# EAGLE design Arduino-Ethernet-v11 (EAGLE 5.06)

## Sheet 1 of 2
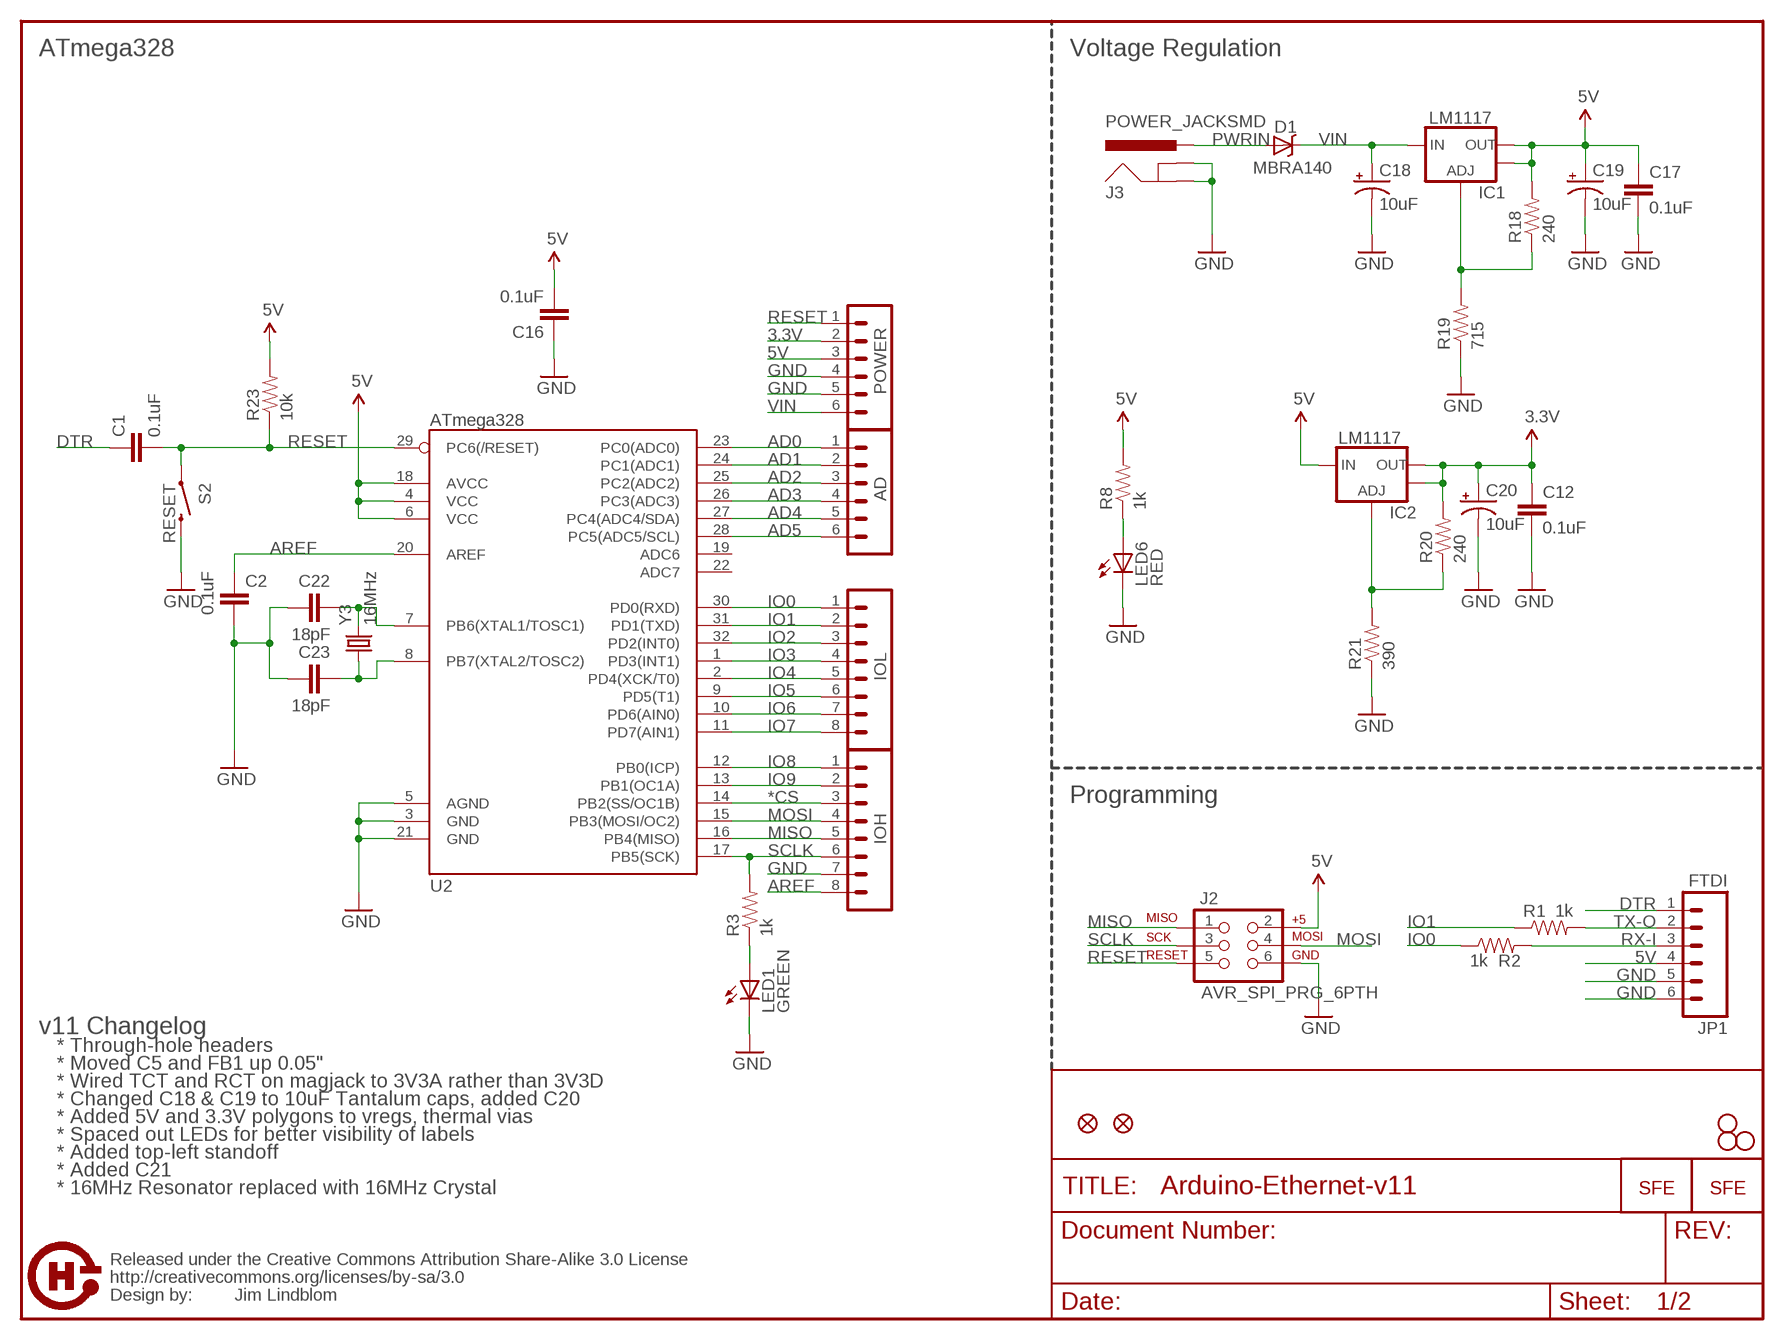
[diagram p0: schematic, sheet 1]

### Parts
$$U$1  CREATIVE_COMMONS  [CREATIVE_COMMONS]
AD  M06SIP  [1X06]
C1  0.1uF  CAP0402-CAP  [0402-CAP]
C2  0.1uF  CAP0402-CAP  [0402-CAP]
C12  0.1uF  CAP0402-CAP  [0402-CAP]
C16  0.1uF  CAP0402-CAP  [0402-CAP]
C17  0.1uF  CAP0402-CAP  [0402-CAP]
C18  10uF  CAP_POL1206  [EIA3216]
C19  10uF  CAP_POL1206  [EIA3216]
C20  10uF  CAP_POL1206  [EIA3216]
C22  18pF  CAP0402-CAP  [0402-CAP]
C23  18pF  CAP0402-CAP  [0402-CAP]
D1  MBRA140  DIODE-SCHOTTKY_  [SMA-DIODE]
IC1  LM1117  V_REG_LM1117SOT223  [SOT223]
IC2  LM1117  V_REG_LM1117SOT223  [SOT223]
IOH  M08  [1X08]
IOL  M08  [1X08]
J2  AVR_SPI_PRG_6PTH  [2X3]
J3  POWER_JACKSMD  [POWER_JACK_SMD]
JP1  FTDI  M06SMD  [1X06-SMD]
JP2  STAND-OFF  [STAND-OFF]
JP3  LOGO-SFENW2  [SFE-NEW-WEB]
JP4  STAND-OFF  [STAND-OFF]
JP7  LOGO-SFESK  [SFE-LOGO-FLAME]
JP8  STAND-OFF  [STAND-OFF]
JP9  FIDUCIAL1X2  [FIDUCIAL-1X2]
JP10  FIDUCIAL1X2  [FIDUCIAL-1X2]
LED1  GREEN  LED0603  [LED-0603]
LED6  RED  LED0603  [LED-0603]
POWER  M06SIP  [1X06]
R1  1k  RESISTOR0402-RES  [0402-RES]
R2  1k  RESISTOR0402-RES  [0402-RES]
R3  1k  RESISTOR0402-RES  [0402-RES]
R8  1k  RESISTOR0402-RES  [0402-RES]
R18  240  RESISTOR0402-RES  [0402-RES]
R19  715  RESISTOR0402-RES  [0402-RES]
R20  240  RESISTOR0402-RES  [0402-RES]
R21  390  RESISTOR0402-RES  [0402-RES]
R23  10k  RESISTOR0402-RES  [0402-RES]
S2  RESET  SWITCH-MOMENTARY-2SMD  [TACTILE_SWITCH_SMD]
U2  ATmega328  ATMEGA168  [TQFP32-08]
U$100  OSHW-LOGO  [OSHW-LOGO]
Y3  16MHz  CRYSTAL5X3  [CRYSTAL-SMD-5X3]

### Nets
3.3V: C12.1 C20.A(+) IC2.2(OUT) IC2.4(OUT) POWER.2 R20.2 ; also sheet 2
5V: C16.2 C17.1 C19.A(+) IC1.2(OUT) IC1.4(OUT) IC2.3(IN) J2.2 JP1.4 POWER.3 R8.2 R18.2 R23.2 U2.4(VCC) U2.6(VCC) U2.18(AVCC)
*CS: IOH.3 U2.14(PB2(SS/OC1B)) ; also sheet 2
AD0: AD.1 U2.23(PC0(ADC0))
AD1: AD.2 U2.24(PC1(ADC1))
AD2: AD.3 U2.25(PC2(ADC2))
AD3: AD.4 U2.26(PC3(ADC3))
AD4: AD.5 U2.27(PC4(ADC4/SDA))
AD5: AD.6 U2.28(PC5(ADC5/SCL))
AREF: C2.1 IOH.8 U2.20(AREF)
DTR: C1.1 JP1.1
GND: C2.2 C12.2 C16.1 C17.2 C18.C(-) C19.C(-) C20.C(-) C22.1 C23.1 IOH.7 J2.6 J3.GND(GNDBREAK) J3.P$4(GND) JP1.5 JP1.6 LED1.C LED6.C POWER.4 POWER.5 R19.1 R21.1 S2.3 U2.3(GND) U2.5(AGND) U2.21(GND) ; also sheet 2
IO0: IOL.1 R2.1 U2.30(PD0(RXD))
IO1: IOL.2 R1.1 U2.31(PD1(TXD))
IO2: IOL.3 U2.32(PD2(INT0)) ; also sheet 2
IO3: IOL.4 U2.1(PD3(INT1))
IO4: IOL.5 U2.2(PD4(XCK/T0))
IO5: IOL.6 U2.9(PD5(T1))
IO6: IOL.7 U2.10(PD6(AIN0))
IO7: IOL.8 U2.11(PD7(AIN1))
IO8: IOH.1 U2.12(PB0(ICP))
IO9: IOH.2 U2.13(PB1(OC1A))
MISO: IOH.5 J2.1 U2.16(PB4(MISO)) ; also sheet 2
MOSI: IOH.4 J2.4 U2.15(PB3(MOSI/OC2)) ; also sheet 2
N$1: LED1.A R3.1
N$6: C22.2 U2.7(PB6(XTAL1/TOSC1)) Y3.3
N$8: LED6.A R8.1
N$13: IC2.1(ADJ) R20.1 R21.2
N$16: C23.2 U2.8(PB7(XTAL2/TOSC2)) Y3.1
N$17: IC1.1(ADJ) R18.1 R19.2
PWRIN: D1.A J3.VIN0(PWR)
RESET: C1.2 J2.5 POWER.1 R23.1 S2.1 U2.29(PC6(/RESET)) ; also sheet 2
RX-I: JP1.3 R2.2
SCLK: IOH.6 J2.3 R3.2 U2.17(PB5(SCK)) ; also sheet 2
TX-O: JP1.2 R1.2
VIN: C18.A(+) D1.C IC1.3(IN) POWER.6
Unconnected: U2.19(ADC6) U2.22(ADC7)

### Notes on the sheet
- ATmega328 | Voltage Regulation
- Programming
- v11 Changelog
- * Through-hole headers
- * Moved C5 and FB1 up 0.05"
- * Wired TCT and RCT on magjack to 3V3A rather than 3V3D
- * Changed C18 & C19 to 10uF Tantalum caps, added C20
- * Added 5V and 3.3V polygons to vregs, thermal vias
- * Spaced out LEDs for better visibility of labels
- * Added top-left standoff
- * Added C21
- * 16MHz Resonator replaced with 16MHz Crystal
- Jim Lindblom

## Sheet 2 of 2
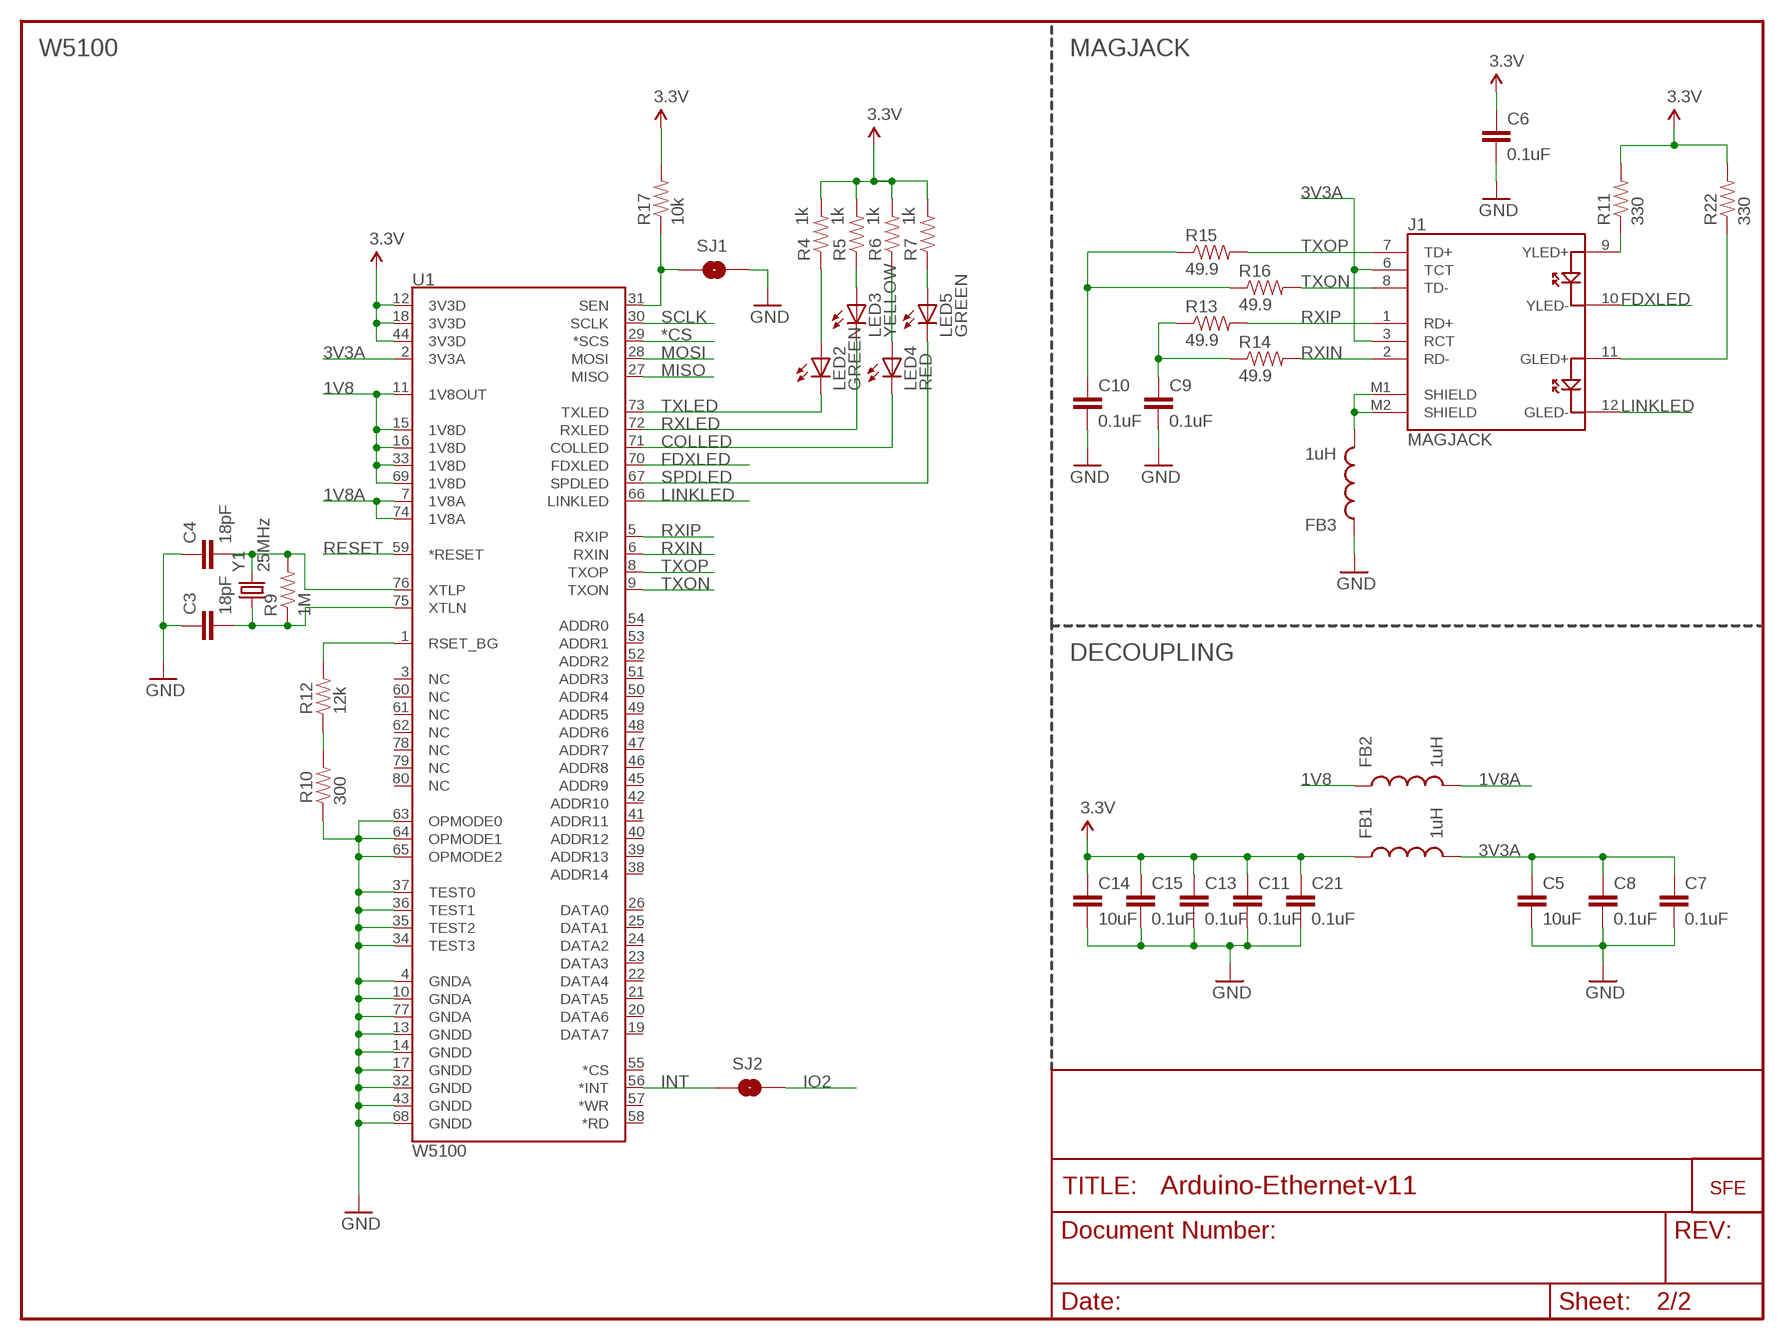
[diagram p1: schematic, sheet 2]

### Parts
C3  18pF  CAP0402-CAP  [0402-CAP]
C4  18pF  CAP0402-CAP  [0402-CAP]
C5  10uF  CAP1206  [1206]
C6  0.1uF  CAP0402-CAP  [0402-CAP]
C7  0.1uF  CAP0402-CAP  [0402-CAP]
C8  0.1uF  CAP0402-CAP  [0402-CAP]
C9  0.1uF  CAP0402-CAP  [0402-CAP]
C10  0.1uF  CAP0402-CAP  [0402-CAP]
C11  0.1uF  CAP0402-CAP  [0402-CAP]
C13  0.1uF  CAP0402-CAP  [0402-CAP]
C14  10uF  CAP1206  [1206]
C15  0.1uF  CAP0402-CAP  [0402-CAP]
C21  0.1uF  CAP0402-CAP  [0402-CAP]
FB1  1uH  INDUCTOR0805  [0805]
FB2  1uH  INDUCTOR0805  [0805]
FB3  1uH  INDUCTOR0805  [0805]
J1  MAGJACK  [MAGJACK]
JP6  LOGO-SFENEW  [SFE-NEW-WEBLOGO]
LED2  GREEN  LED0603  [LED-0603]
LED3  YELLOW  LED0603  [LED-0603]
LED4  RED  LED0603  [LED-0603]
LED5  GREEN  LED0603  [LED-0603]
R4  1k  RESISTOR0402-RES  [0402-RES]
R5  1k  RESISTOR0402-RES  [0402-RES]
R6  1k  RESISTOR0402-RES  [0402-RES]
R7  1k  RESISTOR0402-RES  [0402-RES]
R9  1M  RESISTOR0402-RES  [0402-RES]
R10  300  RESISTOR0402-RES  [0402-RES]
R11  330  RESISTOR0402-RES  [0402-RES]
R12  12k  RESISTOR0402-RES  [0402-RES]
R13  49.9  RESISTOR0402-RES  [0402-RES]
R14  49.9  RESISTOR0402-RES  [0402-RES]
R15  49.9  RESISTOR0402-RES  [0402-RES]
R16  49.9  RESISTOR0402-RES  [0402-RES]
R17  10k  RESISTOR0402-RES  [0402-RES]
R22  330  RESISTOR0402-RES  [0402-RES]
SJ1  SOLDERJUMPERNO  [SJ_2S-NO]
SJ2  SOLDERJUMPERNO  [SJ_2S-NO]
U1  W5100  [LQFP-80]
Y1  25MHz  CRYSTAL5X3  [CRYSTAL-SMD-5X3]

### Nets
1V8: FB2.1 U1.11(1V8OUT) U1.15(1V8D) U1.16(1V8D) U1.33(1V8D) U1.69(1V8D)
1V8A: FB2.2 U1.7(1V8A) U1.74(1V8A)
3.3V: C6.1 C11.1 C13.1 C14.1 C15.1 C21.1 FB1.1 R4.2 R5.2 R6.2 R7.2 R11.2 R17.2 R22.2 U1.12(3V3D) U1.18(3V3D) U1.44(3V3D) ; also sheet 1
3V3A: C5.1 C7.1 C8.1 FB1.2 J1.3(RCT) J1.6(TCT) U1.2(3V3A)
*CS: U1.29(*SCS) ; also sheet 1
CHGND: FB3.2 J1.M1(SHIELD) J1.M2(SHIELD)
COLLED: LED4.C U1.71(COLLED)
FDXLED: J1.10(YLED-) U1.70(FDXLED)
GND: C3.1 C4.1 C5.2 C6.2 C7.2 C8.2 C9.2 C10.2 C11.2 C13.2 C14.2 C15.2 C21.2 FB3.1 R10.1 SJ1.2 U1.4(GNDA) U1.10(GNDA) U1.13(GNDD) U1.14(GNDD) U1.17(GNDD) U1.32(GNDD) U1.34(TEST3) U1.35(TEST2) U1.36(TEST1) U1.37(TEST0) U1.43(GNDD) U1.63(OPMODE0) U1.64(OPMODE1) U1.65(OPMODE2) U1.68(GNDD) U1.77(GNDA) ; also sheet 1
INT: SJ2.1 U1.56(*INT)
IO2: SJ2.2 ; also sheet 1
LINKLED: J1.12(GLED-) U1.66(LINKLED)
MISO: U1.27(MISO) ; also sheet 1
MOSI: U1.28(MOSI) ; also sheet 1
N$2: C4.2 R9.2 U1.76(XTLP) Y1.3
N$3: C3.2 R9.1 U1.75(XTLN) Y1.1
N$4: J1.9(YLED+) R11.1
N$5: J1.11(GLED+) R22.1
N$7: C10.1 R15.1 R16.1
N$9: C9.1 R13.1 R14.1
N$10: LED2.A R4.1
N$11: LED3.A R5.1
N$12: LED4.A R6.1
N$14: LED5.A R7.1
N$15: R10.2 R12.1
RESET: U1.59(*RESET) ; also sheet 1
RSET_BG: R12.2 U1.1(RSET_BG)
RXIN: J1.2(RD-) R14.2 U1.6(RXIN)
RXIP: J1.1(RD+) R13.2 U1.5(RXIP)
RXLED: LED3.C U1.72(RXLED)
SCLK: U1.30(SCLK) ; also sheet 1
SEN: R17.1 SJ1.1 U1.31(SEN)
SPDLED: LED5.C U1.67(SPDLED)
TXLED: LED2.C U1.73(TXLED)
TXON: J1.8(TD-) R16.2 U1.9(TXON)
TXOP: J1.7(TD+) R15.2 U1.8(TXOP)
Unconnected: U1.3(NC) U1.19(DATA7) U1.20(DATA6) U1.21(DATA5) U1.22(DATA4) U1.23(DATA3) U1.24(DATA2) U1.25(DATA1) U1.26(DATA0) U1.38(ADDR14) U1.39(ADDR13) U1.40(ADDR12) U1.41(ADDR11) U1.42(ADDR10) U1.45(ADDR9) U1.46(ADDR8) U1.47(ADDR7) U1.48(ADDR6) U1.49(ADDR5) U1.50(ADDR4) U1.51(ADDR3) U1.52(ADDR2) U1.53(ADDR1) U1.54(ADDR0) U1.55(*CS) U1.57(*WR) U1.58(*RD) U1.60(NC) U1.61(NC) U1.62(NC) U1.78(NC) U1.79(NC) U1.80(NC)

### Notes on the sheet
- W5100 | MAGJACK
- DECOUPLING

## Library data of the parts
$$U$1 = SparkFun:CREATIVE_COMMONS
AD JP1 POWER = SparkFun:M06: Header 6 Standard 6-pin 0.1" header. Use with straight break away headers (SKU : PRT-00116), right angle break away headers (PRT-00553), swiss pins (PRT-00743), machine pins (PRT-00117), and female headers (PRT-00115). Molex polarized connector foot print use with SKU : PRT-08094 with associated crimp pins and housings. NOTES ON THE VARIANTS LOCK and LOCK_LONGPADS... This footprint was designed to help hold the alignment of a through-hole component (i.e. 6-pin header) while soldering it into place. You may notice that each hole has been shifted either up or down by 0.005 of an inch from it's more standard position (which is a perfectly straight line). This slight alteration caused the pins (the squares in the middle) to touch the edges of the holes. Because they are alternating, it causes a "brace" to hold the component in place. 0.005 has proven to be the perfect amount of "off-center" position when using our standard breakaway headers. Although looks a little odd when you look at the bare footprint, once you have a header in there, the alteration is very hard to notice. Also, if you push a header all the way into place, it is covered up entirely on the bottom side. This idea of altering the position of holes to aid alignment will be further integrated into the Sparkfun Library for other footprints. It can help hold any component with 3 or more connection pins.
C1-C17 C21-C23 = SparkFun:CAP: Capacitor Standard 0603 ceramic capacitor, and 0.1" leaded capacitor.
C18-C20 = SparkFun:CAP_POL: Capacitor Polarized These are standard SMD and PTH capacitors. Normally 10uF, 47uF, and 100uF in electrolytic and tantalum varieties. Always verify the external diameter of the through hole cap, it varies with capacity, voltage, and manufacturer. The EIA devices should be standard.
D1 = SparkFun:DIODE-SCHOTTKY
FB1-FB3 = SparkFun:INDUCTOR: Inductors Basic Inductor/Choke - 0603 and 1206. Footprints are not proven and vary greatly between part numbers.
IC1 IC2 = SparkFun:V_REG_LM1117: Voltage Regulator LM1117 Standard adjustable voltage regulator but in SMD form. Spark Fun Electronics SKU : COM-00595
IOH IOL = SparkFun:M08: Header 8 Standard 8-pin 0.1" header. Use with straight break away headers (SKU : PRT-00116), right angle break away headers (PRT-00553), swiss pins (PRT-00743), machine pins (PRT-00117), and female headers (PRT-00115).
J1 = SparkFun:MAGJACK
J2 = SparkFun:AVR_SPI_PRG_6: AVR ISP 6 Pin This is the reduced ISP connector for AVR programming. Common on Arduino. This footprint will take up less PCB space and can be used with a 10-pin to 6-pin adapter such as SKU: BOB-08508
J3 = SparkFun:POWER_JACK: Power Jack This is the standard 5.5mm barrel jack for power. The PTH is the most common, proven, reliable, footprint. All others are experimental. The Slot footprint only works if the mill layer is transmitted to the PCB fab house so be warned. Spark Fun Electronics SKU : PRT-00119. Mating wall wart : TOL-00298 (and others)
JP2 JP4 JP8 = SparkFun:STAND-OFF: Stand Off This is the mechanical footprint for a #4 phillips button head screw. Use the keepout ring to avoid running the screw head into surrounding components. SKU : PRT-00447
JP3 JP6 JP7 = SparkFun:LOGO-SFE: Spark Fun Electronics PCB Logo This is the standard Spark Fun Electronics PCB logo.
JP9 JP10 = SparkFun:FIDUCIAL: Fiducial Alignment Points Various fiducial points for machine vision alignment.
LED1-LED6 = SparkFun:LED: LEDs Standard schematic elements and footprints for 5mm, 3mm, 1206, and 0603 sized LEDs. 5mm - Spark Fun Electronics SKU : COM-00529 (and others)
R1-R23 = SparkFun:RESISTOR: Resistor Basic schematic elements and footprints for 0603, 1206, and PTH resistors.
S2 = SparkFun:SWITCH-MOMENTARY-2
SJ1 SJ2 = SparkFun:SOLDERJUMPER: Solder Jumper Standard SMD solder jumper. Used to automate production. Two varients : Normally Open and Normally Closed are the same, but have different paste layers. NC will have a large amount of paste and should jumper during reflow.
U1 = SparkFun:W5100: WIZnet W5100 TCP/IP PHY Embedded Chip See SparkFun catalog # COM-09471 Package: LQFP-80,10x10mm, 0.4mm pitch
U2 = SparkFun:ATMEGA168
U$100 = SparkFun:OSHW-LOGO
Y1 Y3 = SparkFun:CRYSTAL: Crystals Various standard crystals. Proven footprints. Spark Fun Electronics SKU : COM-00534

## Board
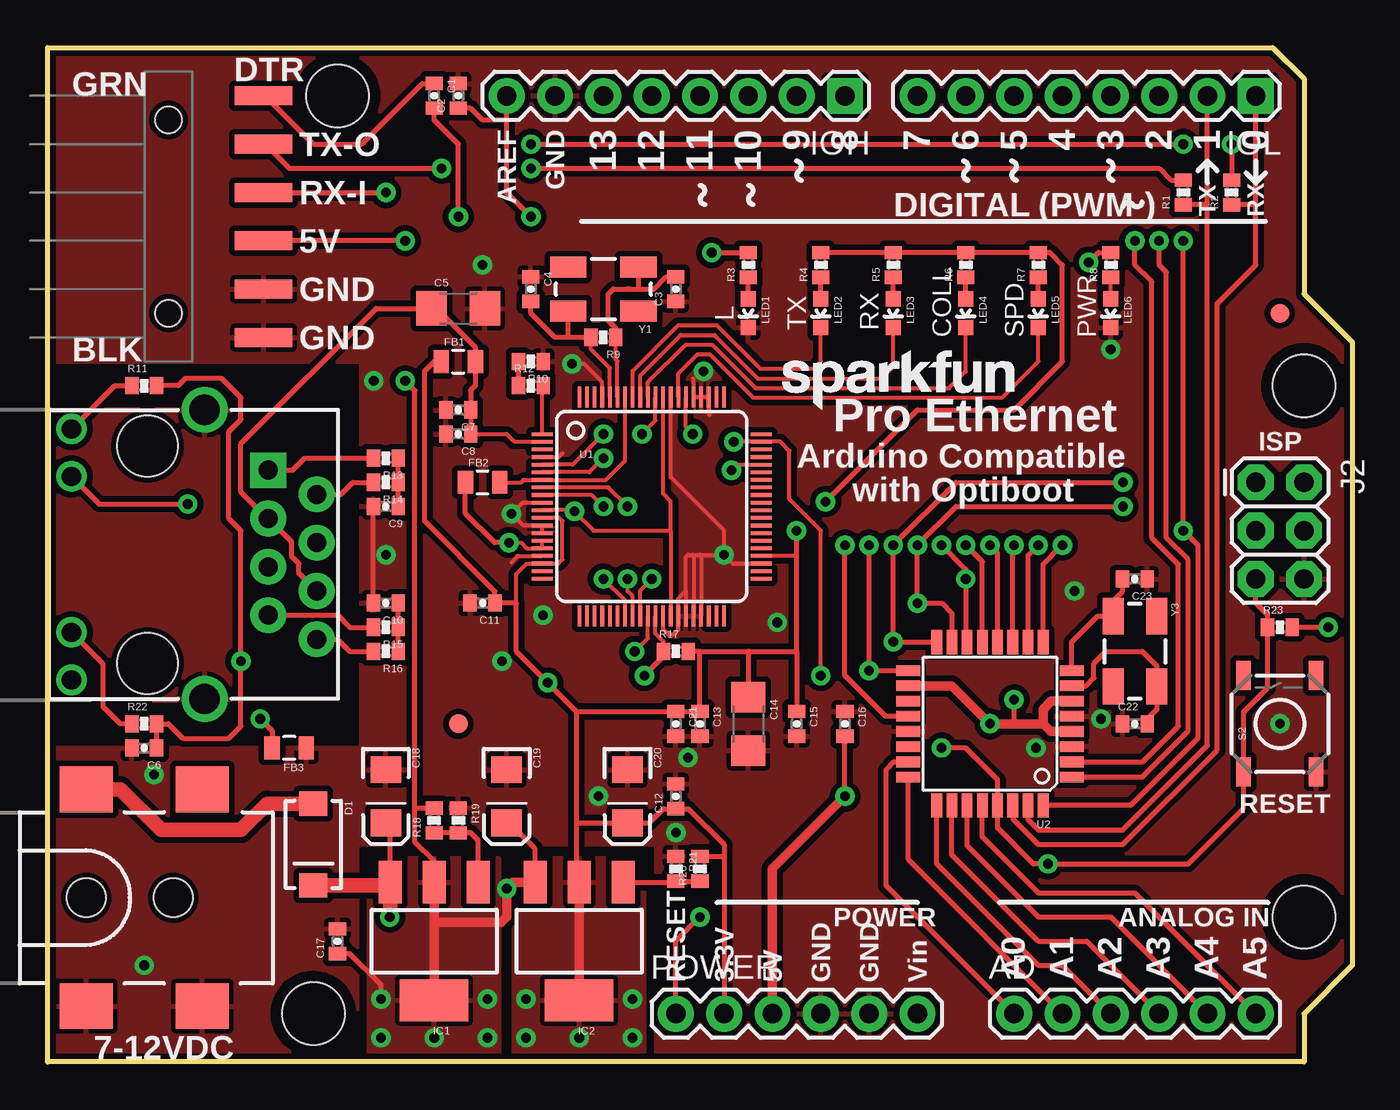
[diagram p2: board, top side]
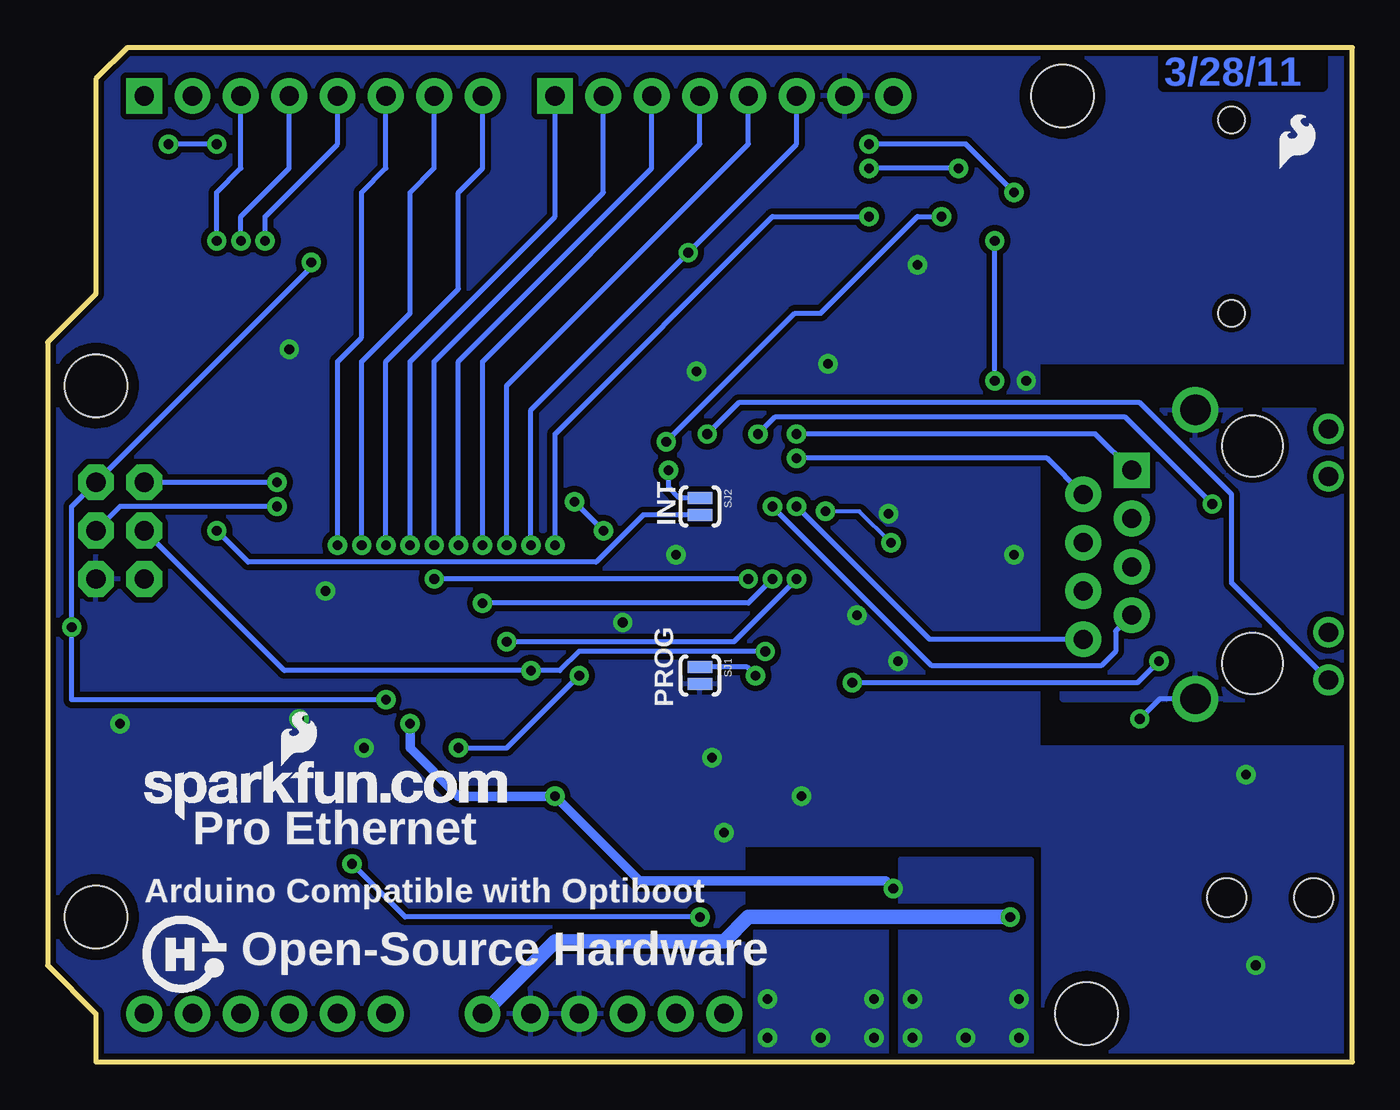
[diagram p3: board, bottom side, seen from below]

Size 68.58 x 53.34 mm. Coordinates in mm from the lower left corner, seen from the top.
Outline: 0,53.34 64.39,53.34 66.04,51.69 66.04,40.39 68.58,37.85 68.58,5.08 66.04,2.54 66.04,0 0,0 0,53.34
Copper layers (1*16): Top 0.035mm / dielectric 1.5mm / Bottom 0.035mm
Design rules "SparkFun *": minimum track width 8mil, minimum drill 20mil, track to track 8mil, track to pad 8mil, pad to pad 8mil, via to via 8mil, smd to smd 8mil, copper to edge 8mil, drill to drill 8mil, minimum pad ring 12mil, minimum via ring 10mil, stop-mask expansion 4mil, vias tented up to drill 20mil, thermal gap 10mil

### Footprints (pad centres in the part's own frame; a part is rotated, then mirrored left to right if it is on the bottom)
1X06 = drill 1.016 pad 1.88 round: 1 0,0; 2 2.54,0; 3 5.08,0; 4 7.62,0; 5 10.16,0; 6 12.7,0
0402-CAP = smd 0.7 x 0.9: 1 -0.65,0; 2 0.65,0
1206 = smd 1.6 x 1.8: 1 -1.4,0; 2 1.4,0
EIA3216 = smd 1.4 x 1.6: A 1.4,0; C -1.4,0
SMA-DIODE = smd 1.27 x 1.47: A -2.15,0; C 2.15,0
0805 = smd 0.8 x 1.2: 1 -0.9,0; 2 0.9,0
SOT223 = smd 1.219 x 2.235: 1 -2.311,-3.099; 2 0,-3.099; 3 2.311,-3.099 | smd 3.6 x 2.2: 4 0,3.099
1X08 = drill 1.016 pad 1.88 square: 1 0,0 | drill 1.016 pad 1.88 round: 2 2.54,0; 3 5.08,0; 4 7.62,0; 5 10.16,0; 6 12.7,0; 7 15.24,0; 8 17.78,0
MAGJACK = drill 1 pad 1.88 square: 1 3.175,17.445 | drill 1 pad 1.88 round: 2 4.445,19.985; 3 5.715,17.445; 4 6.985,19.985; 5 8.255,17.445; 6 9.525,19.985; 7 10.795,17.445; 8 12.065,19.985 | drill 1 pad 1.27 round: 9 1,7.1; 10 3.5,7.1; 11 11.7,7.1; 12 14.2,7.1 | drill 1.6 pad 2.184 round: M1 0,14.1; M2 15.2,14.1 | hole 3.2: 1.905,11.095; 13.335,11.095
2X3 = drill 1.016 pad 1.88 octagon: 1 0,0; 2 0,2.54; 3 2.54,0; 4 2.54,2.54; 5 5.08,0; 6 5.08,2.54
POWER_JACK_SMD = smd 2.8 x 2.4: GND 0,-5.7; P$4 6.1,-5.7; VIN0 0,5.7; VIN1 6.1,5.7 | hole 2.032: 0,0; 4.572,0
1X06-SMD = smd 1 x 3: 1 -6.35,5; 2 -3.81,5; 3 -1.27,5; 4 1.27,5; 5 3.81,5; 6 6.35,5 | hole 1.4: -5.08,0; 5.08,0
STAND-OFF = hole 3.302: 0,0
FIDUCIAL-1X2 = smd 1 x 1: 1 0,0
LED-0603 = smd 0.8 x 0.8: A 0,-0.75; C 0,0.75
0402-RES = smd 0.7 x 0.9: 1 -0.65,0; 2 0.65,0
TACTILE_SWITCH_SMD = smd 1.524 x 0.762: 1 -2.54,1.905; 2 2.54,1.905; 3 -2.54,-1.905; 4 2.54,-1.905
SJ_2S-NO = smd 0.635 x 1.27: 1 -0.45,0; 2 0.45,0
LQFP-80 = smd 0.19 x 1.1: 1 -3.8,-5.75; 2 -3.4,-5.75; 3 -3,-5.75; 4 -2.6,-5.75; 5 -2.2,-5.75; 6 -1.8,-5.75; 7 -1.4,-5.75; 8 -1,-5.75; 9 -0.6,-5.75; 10 -0.2,-5.75; 11 0.2,-5.75; 12 0.6,-5.75; 13 1,-5.75; 14 1.4,-5.75; 15 1.8,-5.75; 16 2.2,-5.75; 17 2.6,-5.75; 18 3,-5.75; 19 3.4,-5.75; 20 3.8,-5.75; 41 3.8,5.75; 42 3.4,5.75; 43 3,5.75; 44 2.6,5.75; 45 2.2,5.75; 46 1.8,5.75; 47 1.4,5.75; 48 1,5.75; 49 0.6,5.75; 50 0.2,5.75; 51 -0.2,5.75; 52 -0.6,5.75; 53 -1,5.75; 54 -1.4,5.75; 55 -1.8,5.75; 56 -2.2,5.75; 57 -2.6,5.75; 58 -3,5.75; 59 -3.4,5.75; 60 -3.8,5.75 | smd 1.1 x 0.19: 21 5.75,-3.8; 22 5.75,-3.4; 23 5.75,-3; 24 5.75,-2.6; 25 5.75,-2.2; 26 5.75,-1.8; 27 5.75,-1.4; 28 5.75,-1; 29 5.75,-0.6; 30 5.75,-0.2; 31 5.75,0.2; 32 5.75,0.6; 33 5.75,1; 34 5.75,1.4; 35 5.75,1.8; 36 5.75,2.2; 37 5.75,2.6; 38 5.75,3; 39 5.75,3.4; 40 5.75,3.8; 61 -5.75,3.8; 62 -5.75,3.4; 63 -5.75,3; 64 -5.75,2.6; 65 -5.75,2.2; 66 -5.75,1.8; 67 -5.75,1.4; 68 -5.75,1; 69 -5.75,0.6; 70 -5.75,0.2; 71 -5.75,-0.2; 72 -5.75,-0.6; 73 -5.75,-1; 74 -5.75,-1.4; 75 -5.75,-1.8; 76 -5.75,-2.2; 77 -5.75,-2.6; 78 -5.75,-3; 79 -5.75,-3.4; 80 -5.75,-3.8
TQFP32-08 = smd 1.27 x 0.559: 1 -4.293,2.8; 2 -4.293,2; 3 -4.293,1.2; 4 -4.293,0.4; 5 -4.293,-0.4; 6 -4.293,-1.2; 7 -4.293,-2; 8 -4.293,-2.8; 17 4.293,-2.8; 18 4.293,-2; 19 4.293,-1.2; 20 4.293,-0.4; 21 4.293,0.4; 22 4.293,1.2; 23 4.293,2; 24 4.293,2.8 | smd 0.559 x 1.27: 9 -2.8,-4.293; 10 -2,-4.293; 11 -1.2,-4.293; 12 -0.4,-4.293; 13 0.4,-4.293; 14 1.2,-4.293; 15 2,-4.293; 16 2.8,-4.293; 25 2.8,4.293; 26 2,4.293; 27 1.2,4.293; 28 0.4,4.293; 29 -0.4,4.293; 30 -1.2,4.293; 31 -2,4.293; 32 -2.8,4.293
CRYSTAL-SMD-5X3 = smd 1.9 x 1.1: 1 -1.85,-1.15; 2 1.85,-1.15; 3 1.85,1.15; 4 -1.85,1.15

### Placement (x,y rotation side)
$$U$1  0,-8.89 0 top  (outside the outline)
AD  50.8,2.54 0 top
C1  20.32,50.8 270 top
C2  21.59,50.8 90 top
C3  33.02,40.64 90 top
C4  25.4,40.64 270 top
C5  21.59,39.62 0 top
C6  5.08,16.51 180 top
C7  21.59,34.29 180 top
C8  21.59,33.02 180 top
C9  17.78,29.21 180 top
C10  17.78,24.13 180 top
C11  22.86,24.13 180 top
C12  33.02,13.97 90 top
C13  34.29,17.78 270 top
C14  36.83,17.78 270 top
C15  39.37,17.78 270 top
C16  41.91,17.78 270 top
C17  15.24,6.35 90 top
C18  17.78,13.97 270 top
C19  24.13,13.97 270 top
C20  30.48,13.97 270 top
C21  33.02,17.78 270 top
C22  57.15,17.78 0 top
C23  57.15,25.4 180 top
D1  13.97,11.43 270 top
FB1  21.59,36.83 0 top
FB2  22.86,30.48 0 top
FB3  12.7,16.51 180 top
IC1  20.32,6.35 180 top
IC2  27.94,6.35 180 top
IOH  41.91,50.8 180 top
IOL  63.5,50.8 180 top
J1  -5.84,34.29 270 top
J2  63.5,30.48 270 top
J3  2.03,8.64 0 top
JP1  6.35,44.45 270 top
JP2  66.04,35.56 0 top
JP3  38.61,34.29 0 top
JP4  66.04,7.62 0 top
JP5  STAND-OFF  [STAND-OFF]  13.97,2.54 0 top
JP6  63.5,12.7 0 bottom
JP7  3.81,46.99 0 bottom
JP8  15.24,50.8 0 top
JP9  64.77,39.37 0 top
JP10  21.59,17.78 0 top
LED1  36.83,39.37 180 top
LED2  40.64,39.37 180 top
LED3  44.45,39.37 180 top
LED4  48.26,39.37 180 top
LED5  52.07,39.37 180 top
LED6  55.88,39.37 180 top
POWER  33.02,2.54 0 top
R1  59.69,45.72 90 top
R2  62.23,45.72 90 top
R3  36.83,41.91 90 top
R4  40.64,41.91 90 top
R5  44.45,41.91 90 top
R6  48.26,41.91 90 top
R7  52.07,41.91 90 top
R8  55.88,41.91 90 top
R9  29.21,38.1 180 top
R10  25.4,36.83 180 top
R11  5.08,35.56 0 top
R12  25.4,35.56 0 top
R13  17.78,31.75 180 top
R14  17.78,30.48 180 top
R15  17.78,22.86 180 top
R16  17.78,21.59 180 top
R17  33.02,21.59 0 top
R18  20.32,12.7 90 top
R19  21.59,12.7 270 top
R20  34.29,10.16 90 top
R21  33.02,10.16 270 top
R22  5.08,17.78 0 top
R23  64.77,22.86 0 top
S2  64.77,17.78 90 top
SJ1  34.29,20.32 270 bottom
SJ2  34.29,29.21 270 bottom
U1  31.75,29.21 270 top
U2  49.53,17.78 180 top
U$100  61.59,5.71 0 bottom
Y1  29.21,40.64 180 top
Y3  57.15,21.59 270 top

### Tracks (layer width: path | path; a pad name or v marks a point on that pad's centre or on a via)
1V8  (via drill 0.51)
  Top 0.203: U1.15 U1.16 25.19,27.01 24.89,27.3 v24.26,27.3 | 32.75,27.94 U1.33 | 32.75,27.94 32.75,29.48 32.35,29.88 U1.69 | U1.11 27.63,29.01 v27.69,28.96 28.7,27.94 32.75,27.94
  Top 0.254: v24.26,27.3 23.5,27.3 21.96,28.84 FB2.1
  Bottom 0.203: v27.69,28.96 25.91,28.96 v24.26,27.3
1V8A
  Top 0.203: U1.74 30.35,31.62 29.34,30.61 U1.7 25.02,30.61 24.89,30.48 FB2.2
3.3V  (via drill 0.51)
  Top 0.203: U1.12 26.89,28.61 27.05,28.45 27.05,26.42 26.84,26.21 U1.18 25.19,26.21 24.64,25.65 24.64,24.13 | U1.44 39.31,26.61 39.37,26.67
  Top 0.254: 39.37,21.59 C15.1 | 39.37,21.59 39.37,26.67 v39.37,27.94 | 34.29,21.59 R17.2 | 34.29,21.59 36.83,21.59 | 36.83,21.59 39.37,21.59 | 34.29,21.59 C13.1 C21.1 27.8,18.43 | 36.83,21.59 C14.1 | R4.2 R5.2 R6.2 R7.2 52.69,42.56 53.34,41.91 53.34,36.83 50.8,34.29 45.72,34.29 v40.89,29.46 | C6.1 R22.2 6.35,17.78 7.11,17.02 9.53,17.02 10.16,17.65 v10.16,21.08 10.16,27.94 9.53,28.57 9.53,33.15 10.16,33.78 10.16,34.92 9.14,35.94 7.24,35.94 6.86,35.56 R11.2 | FB1.1 20.32,36.83 19.81,36.32 19.81,28.45 23.51,24.75 C11.1 24.64,24.13 24.64,21.59 v26.29,19.94 27.8,18.43 | R20.2 34.3,10.79 35.56,10.79 | C20.A 30.35,12.7 | C20.A 31.62,12.57 32.37,13.32 C12.1 33.67,13.32 35.56,11.43 35.56,10.79 | 35.56,10.79 POWER.2 | IC2.2 | 27.8,18.43 27.8,12.57 | 27.8,12.57 27.8,9.03 27.94,8.89 | C20.A 27.8,12.57
  Top 0.508: IC2.4 27.94,8.89 IC2.2
  Bottom 0.254: v39.37,27.94 v40.89,29.46 | v26.29,19.94 11.3,19.94 v10.16,21.08
  other vias: 25.15,1.27 25.15,3.3 27.94,1.27 30.73,1.27 30.73,3.3
  pour Bottom (isolate 0.305): 24.51,10.67 24.51,0 31.37,0 31.37,10.67
  pour Top (isolate 0.305): 24.51,10.67 24.51,0 31.37,0 31.37,10.67
3V3A
  Top 0.203: U1.2 24.54,32.61 24.13,33.02 C8.1
  Top 0.254: C8.1 C7.1 22.24,35.32 22.49,35.57 FB1.2 22.49,37.58 20.45,39.62 C5.1 17.27,39.62 10.16,32.51 10.16,29.97 11.56,28.57 J1.3 12.83,27.35 12.83,26.59 13.21,26.21 13.21,25.7 J1.6
5V  (via drill 0.51)
  Top 0.254: v67.31,22.86 R23.2 | v18.8,35.81 19.3,35.31 19.3,13.34 | v41.91,13.97 C16.2 | v18.8,43.18 JP1.4 | v54.72,42.05 55.23,42.56 R8.2 | C17.1 15.89,5.7 17.53,4.06 v17.53,3.3 | 19.3,13.34 19.3,11.56 20.32,10.54 IC1.2 | R18.2 19.32,13.35 19.3,13.34 | IC2.3 25.63,11.2 24.26,12.57 C19.A | 50.8,17.78 v50.8,19.05
  Top 0.508: U2.6 52.76,18.98 52.32,18.54 52.32,17.78 | U2.4 52.72,17.38 52.32,17.78 | 52.32,17.78 50.8,17.78 v49.53,17.78 47.53,19.78 U2.18 | IC1.4 20.32,7.24 | 20.32,7.24 IC1.2 | 20.32,7.24 20.42,7.34 23.85,7.34 24.13,7.62 24.13,8.89 | POWER.3 38.1,10.16 v41.91,13.97 | IC2.3 24.46,9.45 v24.13,9.12
  Bottom 0.254: 67.31,19.05 v67.31,22.86 | 67.31,19.05 67.31,29.21 J2.2 54.72,41.8 v54.72,42.05 | v50.8,19.05 67.31,19.05 | v18.8,35.81 v18.8,43.18
  Bottom 0.508: v49.53,17.78 49.53,16.51 46.99,13.97 v41.91,13.97 37.47,9.53 24.54,9.53 v24.13,9.12
  other vias: 17.53,1.27 23.11,3.3 23.11,1.27 20.32,1.27
  pour Bottom (isolate 0.305): 16.89,10.67 16.89,0 23.75,0 23.75,10.67
  pour Top (isolate 0.305): 16.89,10.67 16.89,0 23.75,0 23.75,10.67
*CS  (via drill 0.51)
  Top 0.203: U1.29 31.15,24.8 v31.75,25.4
  Top 0.254: U2.14 48.26,22.14 v48.26,25.4 48.26,25.91 v46.99,27.18
  Bottom 0.254: v31.75,25.4 v48.26,25.4 | IOH.3 36.83,46.99 46.99,36.83 v46.99,27.18
AD0
  Top 0.254: U2.23 44.48,15.78 44.07,15.37 44.07,9.27 AD.1
AD1
  Top 0.254: U2.24 45.24,10.64 AD.2
AD2
  Top 0.254: U2.25 46.73,10.42 52.07,5.08 53.34,5.08 AD.3
AD3
  Top 0.254: U2.26 47.53,10.89 52.07,6.35 54.61,6.35 AD.4
AD4
  Top 0.254: U2.27 48.33,11.36 52.07,7.62 55.88,7.62 AD.5
AD5
  Top 0.254: AD.6 57.15,8.89 52.07,8.89 49.13,11.83 U2.28
AREF  (via drill 0.51)
  Top 0.254: C2.1 22.24,50.15 22.86,49.53 24.13,49.53 | U2.20 44.05,18.18 41.91,20.32 v41.91,27.18 | 24.13,49.53 24.13,45.72 v25.4,44.45 | 24.13,49.53 IOH.8
  Bottom 0.254: v25.4,44.45 30.48,44.45 41.91,33.02 v41.91,27.18
CHGND  (via drill 0.51)
  Top 0.254: FB3.2 11.8,17.41 v11.18,18.03
  Bottom 0.254: J1.M2 10.12,19.09 v11.18,18.03
  pour Top (isolate 0.305): 0,19.05 15.24,19.05 15.24,34.29 0,34.29
  pour Bottom (isolate 0.305): 0,19.05 15.24,19.05 15.24,34.29 0,34.29
COLLED
  Top 0.203: LED4.C 48.26,36.32 47.37,35.43 37.21,35.43 34.92,37.72 33.53,37.72 31.55,35.74 U1.71
DTR
  Top 0.254: JP1.1 11.81,50.8 11.81,50.42 13.97,48.26 16.51,48.26 19.7,51.45 C1.1
FDXLED  (via drill 0.51)
  Top 0.203: U1.70 31.95,33.73 v31.24,33.02
  Top 0.254: J1.10 2.71,29.34 v7.37,29.34
  Bottom 0.254: v31.24,33.02 30.35,33.91 11.94,33.91 v7.37,29.34
GND  (via drill 0.51)
  Top 0.203: U1.32 32.35,22.77 32.64,22.48 32.89,22.48 33.15,22.74 U1.34 33.15,24.36 33.55,24.77 | U1.14 U1.13 25,28.21 v24.38,28.83 24.96,29.41 U1.10 | U1.17 24.7,26.61 24.38,26.29 | U1.77 29.15,35.75 28.19,36.7 v27.56,36.7 | 33.91,35.94 33.95,35.9 U1.65 U1.64 U1.63 34.75,34.08 34.8,34.04 | U1.4 26.86,31.81 27.05,32 | v35.56,26.67 35.56,27.94 32.75,30.75 U1.68 | v35.56,26.67 35.56,26.61 | U1.43 36.02,26.21 v35.56,26.67 | 33.91,26.67 33.66,26.67 33.55,26.57 33.55,24.77 | 33.91,26.67 34.29,26.67 | 34.29,26.67 v35.56,26.67 | 33.55,24.77 U1.35 | U1.36 33.95,26.63 33.91,26.67 | U1.37 34.35,26.61 34.29,26.67
  Top 0.254: C10.2 C9.2
  other vias: 26.04,23.5 55.37,18.03 38.35,23.11 23.88,21.08 22.86,41.91 51.94,16.51 53.98,24.77 5.08,5.08 55.88,37.47 34.48,36.32 17.14,35.81 64.77,17.78 17.78,26.67 5.59,15.11 33.66,16 28.96,13.97 33.02,12.06
  pour Top (isolate 0.305): 0,0 0,16.51 16.51,16.51 16.51,36.83 0,36.83 0,53.34 68.73,53.34 68.73,0 32,0 32,11.43 16.26,11.43 16.26,0
  pour Bottom (isolate 0.305): 0,0 0,16.51 16.51,16.51 16.51,36.83 0,36.83 -0.1,53.34 68.53,53.34 68.63,0 32,0 32,11.43 16.26,11.43 16.26,0
INT  (via drill 0.51)
  Top 0.203: U1.56 36.24,31.41 v35.94,31.11
  Bottom 0.254: v35.94,31.11 35.94,30.23 35.38,29.66 SJ2.1
IO0
  Top 0.254: 63.5,49.53 IOL.1 63.5,45.09 | U2.30 50.73,12.77 52.07,11.43 56.52,11.43 61.47,16.38 61.47,39.88 63.5,41.91 63.5,45.09 | R2.1 63.48,45.07 63.5,45.09
IO1
  Top 0.254: U2.31 51.53,12.73 52.07,12.19 56.52,12.19 60.96,16.64 60.96,45.09 | 60.96,45.09 IOL.2 | R1.1 60.95,45.07 60.96,45.09
IO2  (via drill 0.51)
  Top 0.254: v59.69,43.18 v59.69,27.94 60.45,27.18 60.45,17.02 56.92,13.49 U2.32
  Bottom 0.254: SJ2.2 37.28,28.76 39.75,26.29 58.04,26.29 v59.69,27.94 | IOL.3 58.42,46.99 59.69,45.72 v59.69,43.18
IO3  (via drill 0.51)
  Top 0.254: v58.42,43.18 58.42,41.91 58.8,41.53 58.8,27.56 59.94,26.42 59.94,17.4 57.52,14.98 U2.1
  Bottom 0.254: IOL.4 55.88,46.99 58.42,44.45 v58.42,43.18
IO4  (via drill 0.51)
  Top 0.254: v57.15,43.18 57.15,41.91 58.04,41.02 58.04,27.56 59.44,26.16 59.44,17.65 57.56,15.78 U2.2
  Bottom 0.254: IOL.5 53.34,48.26 57.15,44.45 v57.15,43.18
IO5  (via drill 0.51)
  Top 0.254: U2.9 52.33,26.17 v53.34,27.18
  Bottom 0.254: IOL.6 50.8,46.99 52.07,45.72 52.07,38.1 53.34,36.83 v53.34,27.18
IO6  (via drill 0.51)
  Top 0.254: U2.10 51.53,26.64 v52.07,27.18
  Bottom 0.254: IOL.7 48.26,46.99 49.53,45.72 49.53,39.37 52.07,36.83 v52.07,27.18
IO7  (via drill 0.51)
  Top 0.254: U2.11 50.73,27.11 v50.8,27.18
  Bottom 0.254: IOL.8 45.72,46.99 46.99,45.72 46.99,40.64 50.8,36.83 v50.8,27.18
IO8  (via drill 0.51)
  Top 0.254: U2.12 49.93,26.78 v49.53,27.18
  Bottom 0.254: IOH.1 41.91,44.45 49.53,36.83 v49.53,27.18
IO9  (via drill 0.51)
  Top 0.254: U2.13 49.13,26.31 v48.26,27.18
  Bottom 0.254: IOH.2 39.37,45.72 48.26,36.83 v48.26,27.18
LINKLED  (via drill 0.51)
  Top 0.203: U1.66 33.55,33.38 v33.91,33.02
  Bottom 0.254: J1.12 6.35,25.18 6.35,29.84 11.18,34.67 32.26,34.67 v33.91,33.02
MISO  (via drill 0.51)
  Top 0.203: U1.27 30.35,24.26 v29.21,25.4
  Top 0.254: U2.16 46.7,22.1 v44.45,22.1 v44.45,27.18 47.75,30.48 v56.52,30.48
  Bottom 0.254: v44.45,22.1 32.51,22.1 v29.21,25.4 | v56.52,30.48 J2.1 | IOH.5 31.75,48.26 44.45,35.56 v44.45,27.18
MOSI  (via drill 0.51)
  Top 0.203: U1.28 30.75,24.5 30.48,24.77 v30.48,25.4
  Top 0.254: U2.15 47.53,23.59 46.99,24.13 v45.72,24.13 v45.72,27.18 47.75,29.21 v56.52,29.21
  Bottom 0.254: J2.4 64.77,29.21 v56.52,29.21 | v30.48,25.4 31.75,24.13 v45.72,24.13 | IOH.4 34.29,48.26 45.72,36.83 v45.72,27.18
N$1
  Top 0.254: LED1.A R3.1
N$2
  Top 0.203: U1.76 29.55,36.49 28.56,37.48 R9.2
  Top 0.254: C4.2 25.4,39.37 26.67,38.1 27.3,38.1 | R9.2 27.3,38.1 | Y1.3 27.36,38.16 27.3,38.1
N$3
  Top 0.203: U1.75 29.95,36.85 29.86,36.94 R9.1
  Top 0.254: R9.1 29.86,38.59 29.46,38.99 29.46,40.39 29.72,40.64 30.48,40.64 | 30.48,40.64 30.61,40.64 | C3.2 32.53,41.29 31.88,40.64 31.11,40.64 | 30.48,40.64 31.11,40.64 | Y1.1 31.06,40.7 31.11,40.64
N$4
  Top 0.254: R11.1 3.53,35.56 J1.9
N$5
  Top 0.254: R22.1 3.81,17.78 2.92,18.67 2.92,20.93 J1.11
N$6
  Top 0.254: C22.2 57.8,18.03 58.3,18.53 Y3.3 58.3,20.82 57.53,21.59 55.63,21.59 54.99,20.95 54.99,20.19 54.58,19.78 U2.7
N$7
  Top 0.254: R16.1 R15.1 C10.1
N$8
  Top 0.203: LED6.A R8.1
N$9
  Top 0.254: R13.1 R14.1 C9.1
N$10
  Top 0.254: LED2.A R4.1
N$11
  Top 0.254: LED3.A R5.1
N$12
  Top 0.254: LED4.A R6.1
N$13
  Top 0.254: R20.1 R21.2 32.96,9.45 IC2.1
N$14
  Top 0.254: LED5.A R7.1
N$15
  Top 0.254: R10.2 R12.1
N$16
  Top 0.254: U2.8 53.82,22.07 55.19,23.44 Y3.1 56,24.25 56.5,24.75 C23.2
N$17
  Top 0.254: 22.86,9.65 22.63,9.42 IC1.1 22.63,11.66 22.24,12.05 R19.2 R18.1
PWRIN
  Top 0.762: J3.VIN0 3.83,14.34 5.97,12.19 10.16,12.19 11.55,13.58 D1.A
RESET  (via drill 0.51)
  Top 0.203: v36.07,32.61 U1.59 38.51,32.61 38.99,32.13 38.99,29.59 40.64,27.94 v40.64,20.32
  Top 0.254: v46.99,16.51 48.26,16.51 49.93,14.84 U2.29 49.93,12.3 51.82,10.41 v52.58,10.41 59.94,10.41 62.87,13.34 S2.1 62.87,18.41 64.12,19.67 R23.1 64.12,23.51 63.5,24.13 J2.5 | v21.59,44.45 21.59,48.26 20.32,49.53 C1.2 | v34.29,7.62 33.02,6.35 POWER.1
  Bottom 0.254: v40.64,20.32 44.45,16.51 v46.99,16.51 | v21.59,44.45 22.86,44.45 27.94,39.37 29.31,39.37 v36.07,32.61 | v34.29,7.62 49.78,7.62 v52.58,10.41
RSET_BG
  Top 0.203: U1.1 26,35.51 R12.2
RX-I  (via drill 0.51)
  Top 0.254: JP1.3 v17.78,45.72 | v25.4,48.26 v59.69,48.26 | v62.23,48.26 R2.2
  Bottom 0.254: v25.4,48.26 20.32,48.26 v17.78,45.72 | v59.69,48.26 v62.23,48.26
RXIN  (via drill 0.51)
  Top 0.203: U1.6 28.47,31.01 v29.21,31.75
  Top 0.254: R14.2 16.05,30.48 15.41,29.84 J1.2
  Bottom 0.254: v29.21,31.75 16.05,31.75 J1.2
RXIP  (via drill 0.51)
  Top 0.203: U1.5 27.6,31.41 v29.21,33.02
  Top 0.254: R13.2 13.51,31.75 12.87,31.11 J1.1
  Bottom 0.254: v29.21,33.02 13.51,33.02 J1.1
RXLED
  Top 0.203: LED3.C 44.45,36.58 43.81,35.94 37.34,35.94 35.05,38.23 33.27,38.23 31.15,36.1 U1.72
SCLK  (via drill 0.51)
  Top 0.203: U1.30 31.55,22.28 v30.86,21.59
  Top 0.254: U2.17 v43.18,20.58 v43.18,27.18 | v34.91,42.56 R3.2
  Bottom 0.254: v30.86,21.59 40.64,21.59 41.65,20.58 v43.18,20.58 56.14,20.58 J2.3 | IOH.6 29.21,48.26 v34.91,42.56 43.18,34.29 v43.18,27.18
SEN  (via drill 0.51)
  Top 0.203: U1.31 31.95,22.53 32.37,22.11 R17.1
  Top 0.254: R17.1 32.37,21.32 v31.37,20.32
  Bottom 0.254: SJ1.1 31.82,20.77 v31.37,20.32
SPDLED
  Top 0.203: LED5.C 52.07,36.83 50.16,34.92 37.08,34.92 34.8,37.21 34.16,37.21 33.15,36.2 U1.67
TX-O  (via drill 0.51)
  Top 0.254: v25.4,46.99 58.42,46.99 59.04,46.37 R1.2 | JP1.2 11.43,48.26 12.7,46.99 v20.7,46.99
  Bottom 0.254: v20.7,46.99 v25.4,46.99
TXLED
  Top 0.203: LED2.C 40.64,36.83 40.26,36.45 37.47,36.45 35.18,38.73 33.15,38.73 30.75,36.34 U1.73
TXON  (via drill 0.51)
  Top 0.203: U1.9 28.61,29.81 v29.21,29.21
  Top 0.254: J1.8 15.24,22.23 15.88,21.59 R16.2
  Bottom 0.254: J1.8 22.23,22.23 v29.21,29.21
TXOP  (via drill 0.51)
  Top 0.203: U1.8 29.48,30.21 v30.48,29.21
  Top 0.254: J1.7 15.24,23.5 15.88,22.86 R15.2
  Bottom 0.254: v30.48,29.21 22.1,20.83 13.21,20.83 12.45,21.59 12.45,22.65 J1.7
VIN  (via drill 0.51)
  Top 0.254: IC1.3 18.01,12.34 C18.A
  Top 0.762: IC1.3 17.98,9.42 17.98,8.89 17.59,9.28 D1.C | IC1.3 17.92,9.53 | v17.98,7.62 18.01,7.64 IC1.3
  Bottom 0.762: POWER.6 41.91,6.35 33.02,6.35 31.75,7.62 v17.98,7.62

### Text on the board
Bottom: 3/28/11
tPlace: DTR | GRN | AREF | GND | 13 | 12 | 11 | 10 | 9 | 8 | 7 | 6 | 5 | 4 | 3 | 2 | 1 | 0 | TX-O | RX-I | DIGITAL | (PWM | ) | TX | RX | 5V | GND | L | TX | RX | COLL | SPD | PWR | BLK | GND | Pro Ethernet | ISP | Arduino Compatible | with Optiboot | RESET | POWER | ANALOG IN | RESET | 3.3V | 5V | GND | GND | Vin | A0 | A1 | A2 | A3 | A4 | A5 | 7-12VDC
bPlace: INT | PROG | Pro Ethernet | Arduino Compatible with Optiboot | Open-Source Hardware